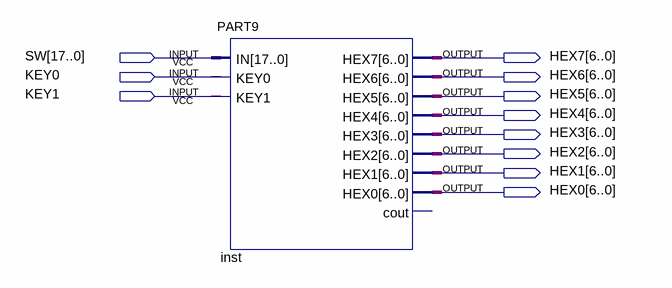
[diagram p0: schematic sheet]
// Quartus schematic lab4.bdf as structural Verilog: 1 symbols, 11 pins
module lab4 (
  input  [17:0] SW,
  input  KEY0,
  input  KEY1,
  output [6:0] HEX7,
  output [6:0] HEX6,
  output [6:0] HEX5,
  output [6:0] HEX4,
  output [6:0] HEX3,
  output [6:0] HEX2,
  output [6:0] HEX1,
  output [6:0] HEX0
);

  PART9 inst (
    .IN(SW), .KEY0(KEY0), .KEY1(KEY1), .HEX7(HEX7), .HEX6(HEX6), .HEX5(HEX5), .HEX4(HEX4), .HEX3(HEX3),
    .HEX2(HEX2), .HEX1(HEX1), .HEX0(HEX0));  // open: cout
endmodule
